# Altium schematic sheet SensorBoard.SchDoc: GROUND WATER MONITORING SYSTEM (part 2 of 2)
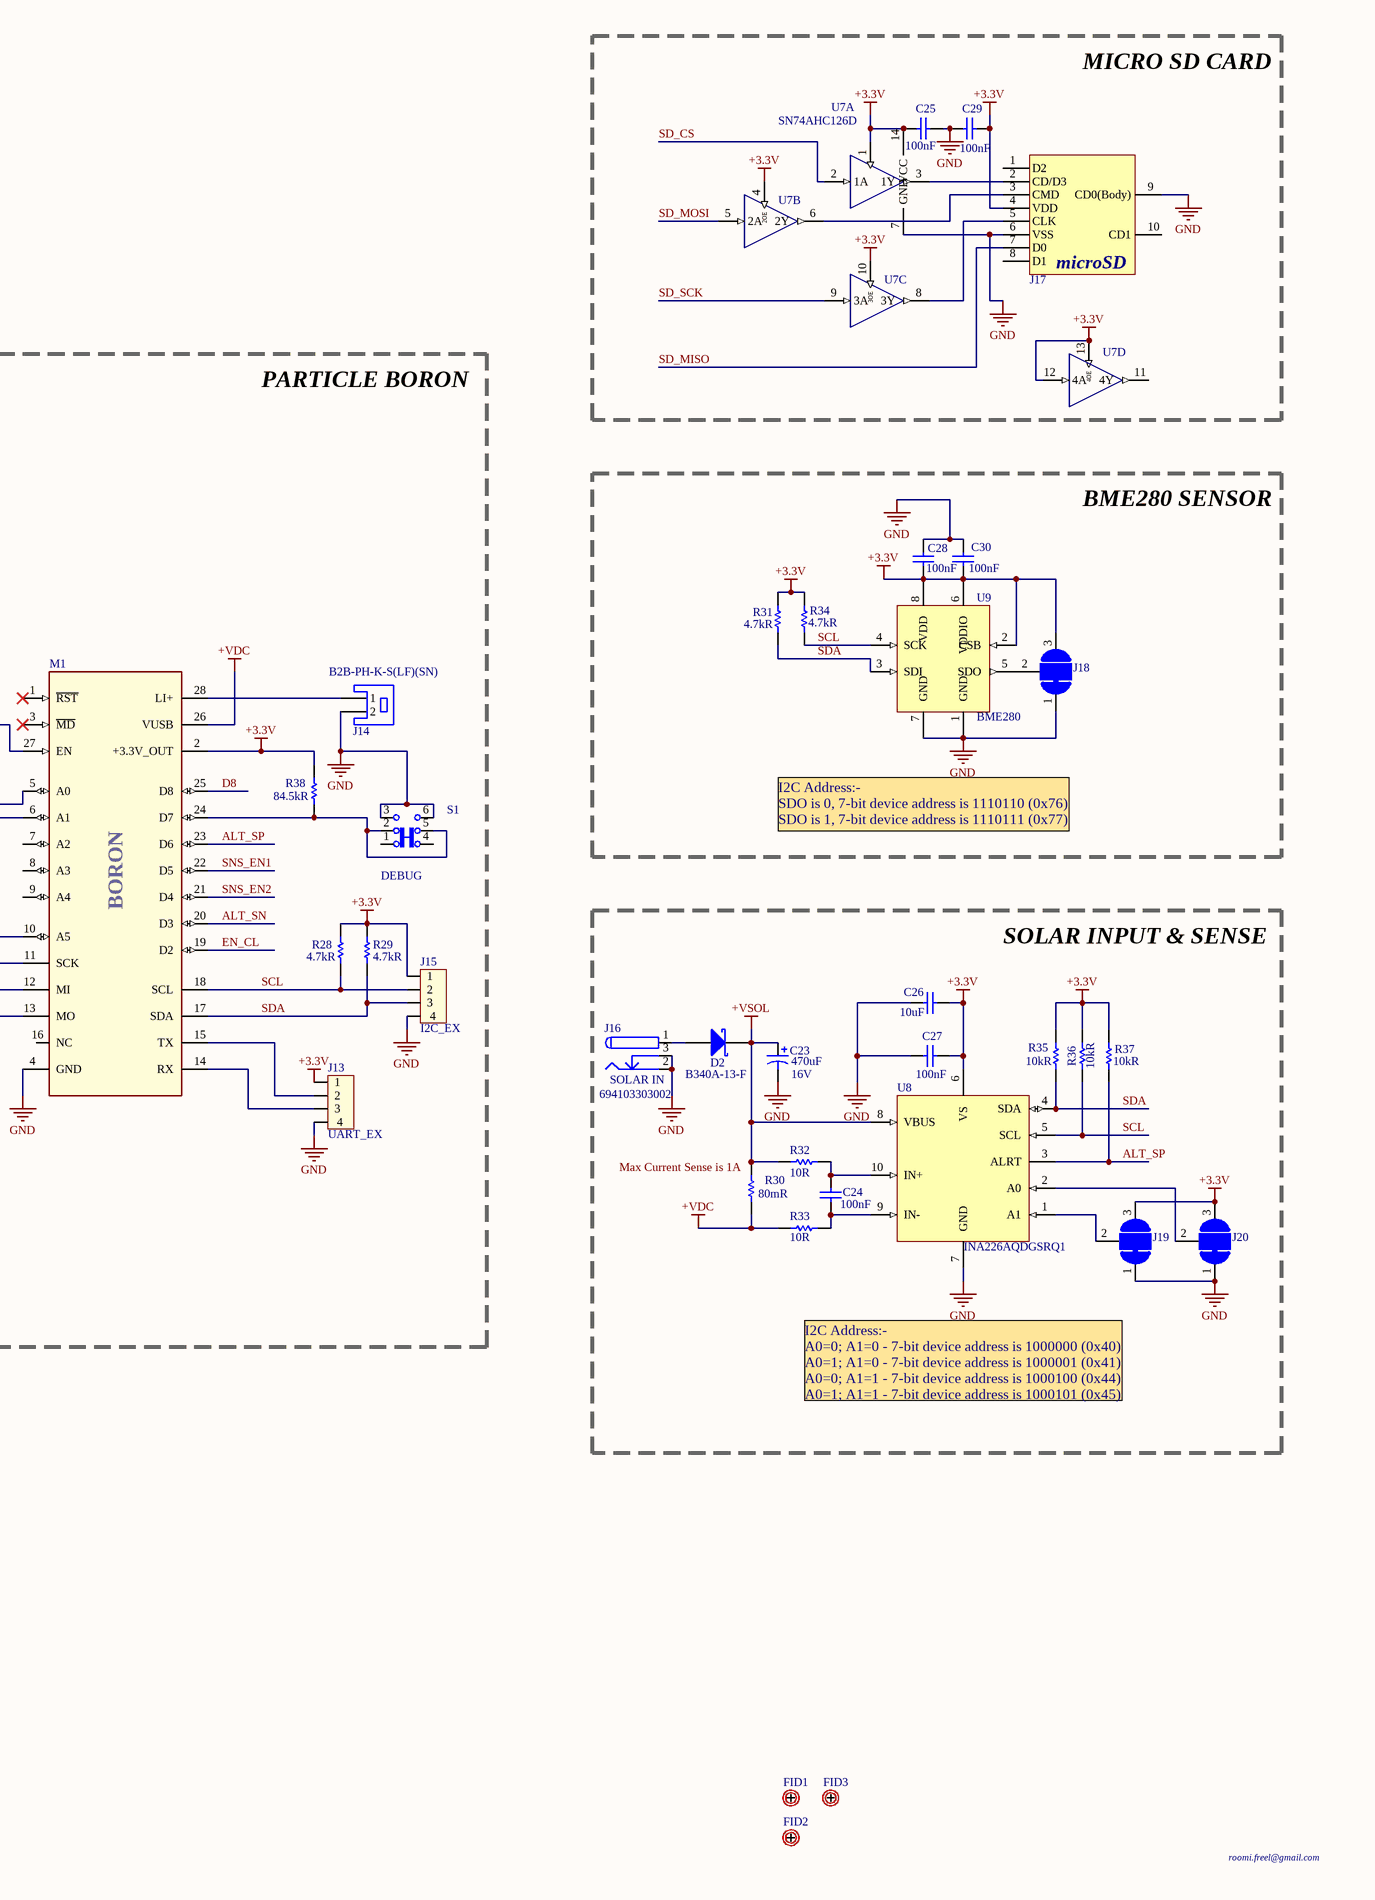
[diagram p2: SensorBoard.SchDoc, right]

## Library data of the parts
C1 C3 C5 C7 C9 C12 C14 C16 C18 = Capacitor: Capacitor Non Polar; Manufacturer: Taiyo Yuden; Manufacturer Part Number: TMK316AB7106KLHT; Tolerance: 10%; Voltage Rating: 25V; Dielectric: X7R; Supplier 1: Digi-Key; Supplier Part Number 1: 587-3485-1-ND; RoHS: Yes; Stock 1: 157997; Pricing 1: 1 = 0.53000, 10 = 0.36800, 100 = 0.22110, 500 = 0.16580, 1000 = 0.14001 (USD); Mount: Surface Mount; Case/Package: 1206; Case Code (Metric): 3216; Case Code (Imperial): 1206; Min Operating Temperature: -55°C; Max Operating Temperature: 125°C; Package Quantity: 2000; Packaging: Tape and Reel; Capacitance: 10uF; Voltage Rating (DC): 25V; Termination: SMD/SMT; Length: 0.126inch; Height: 1.6mm; Width: 0.063inch; Thickness: 0.071inch; Ratings: AEC-Q200; Lead Free: Lead Free; Halogen Free: Halogen Free
C2 C4 C6 C8 C10 C11 C13 C15 C17 C19 C20 C25 C28-C30 = Capacitor: Capacitor Non Polar; Manufacturer: Samsung; Manufacturer Part Number: CL21B104KCFWPNE; Voltage Rating: 100V; Tolerance: 10%; Supplier 1: Digi-Key; Supplier Part Number 1: 1276-6733-1-ND; RoHS: Yes; Stock 1: 24573; Pricing 1: 1 = 0.19000, 10 = 0.13400, 100 = 0.06310, 500 = 0.04422, 1000 = 0.03660 (USD); Mount: Surface Mount; Case/Package: 0805; Case Code (Metric): 2012; Case Code (Imperial): 0805; Min Operating Temperature: -55°C; Max Operating Temperature: 125°C; Packaging: Tape and Reel; Capacitance: 100nF; Features: Soft Termination; Length: 0.079inch; Width: 0.049inch; Thickness: 0.053inch; Ratings: AEC-Q200
C21 = Capacitor: Capacitor Non Polar; Manufacturer: Samsung; Manufacturer Part Number: CL21B471KC6WPNC; Voltage Rating: 100V; Tolerance: 10%; Supplier 1: Digi-Key; Supplier Part Number 1: 1276-6597-1-ND; RoHS: Yes; Stock 1: 22710; Pricing 1: 1 = 0.12000, 10 = 0.08300, 100 = 0.03930, 500 = 0.02752, 1000 = 0.02279 (USD); Mount: Surface Mount; Case/Package: 0805; Case Code (Metric): 2012; Case Code (Imperial): 0805; Min Operating Temperature: -55°C; Max Operating Temperature: 125°C; Packaging: Tape and Reel; Capacitance: 470pF; Features: Soft Termination; Length: 0.079inch; Width: 0.049inch; Thickness: 0.028inch; Ratings: AEC-Q200
C22 = Capacitor: Capacitor Non Polar; Manufacturer: Murata; Manufacturer Part Number: GCJ31CR71E475KA12L; Tolerance: 10%; Voltage Rating: 25V; Dielectric: X7R; Supplier 1: Digi-Key; Supplier Part Number 1: 490-5808-1-ND; RoHS: Yes; Stock 1: 80568; Pricing 1: 1 = 0.82000, 10 = 0.57600, 100 = 0.37950, 500 = 0.28114, 1000 = 0.23897 (USD); Mount: Surface Mount; Case/Package: 1206; Case Code (Imperial): 1206; Case Code (Metric): 3216; Min Operating Temperature: -55°C; Max Operating Temperature: 125°C; Capacitance: 4.7uF; Packaging: Tape and Reel; Package Quantity: 2000; Termination: SMD/SMT; Voltage Rating (DC): 25V; Features: Soft Termination; Length: 0.126inch; Width: 0.063inch; Thickness: 0.075inch; Depth: 1.6mm; Ratings: AEC-Q200; Lead Free: Lead Free; ComponentLink1URL: http://www.murata.com/~/media/webrenewal/support/library/catalog/products/capacitor/mlcc/c03e.ashx; ComponentLink1Description: http://www.murata.com/~/media/webrenewal/support/library/catalog/products/capacitor/mlcc/c03e.ashx; ComponentLink2URL: http://search.murata.co.jp/Ceramy/image/img/A01X/partnumbering_e_02.pdf; ComponentLink2Description: http://search.murata.co.jp/Ceramy/image/img/A01X/partnumbering_e_02.pdf
C23 = Capacitor-Pol: Capacitor Polar; Manufacturer: Panasonic; Manufacturer Part Number: EEEHC1C471P; Dielectric Material: Aluminium; Tolerance: 20%; Ripple Current: 340mA; Life (Hours): 5000Hour; Leakage Current: 3uA; Supplier 1: Digi-Key; Supplier Part Number 1: PCE3751CT-ND; RoHS: Yes; Stock 1: 14134; Pricing 1: 1 = 0.85000, 10 = 0.62600, 100 = 0.42920 (USD); Mount: PCB,Surface Mount; Case/Package: Radial; Number of Pins: 2; Contact Plating: Tin; Min Operating Temperature: -40°C; Max Operating Temperature: 105°C; Capacitance: 470uF; Packaging: Tape and Reel; Voltage Rating: 16V; Package Quantity: 500; Ripple Current (AC): 340mA; Polarity: Polar; Termination: SMD/SMT; Voltage: 16V; Diameter: 10mm; Length: 10.2mm; Height: 10.2mm; Height - Seated (Max): 0.402inch; Lead Pitch: 4.6mm; Width: 900um; Radiation Hardening: No; REACH SVHC: No SVHC; Lead Free: Lead Free; ComponentLink1URL: http://www.farnell.com/datasheets/2059746.pdf; ComponentLink1Description: http://www.farnell.com/datasheets/2059746.pdf; ComponentLink2URL: http://industrial.panasonic.com/www-data/pdf/ABA0000/ABA0000CE109.pdf; ComponentLink2Description: http://industrial.panasonic.com/www-data/pdf/ABA0000/ABA0000CE109.pdf; ComponentLink3URL: http://www.farnell.com/datasheets/2244689.pdf; ComponentLink3Description: http://www.farnell.com/datasheets/2244689.pdf; ComponentLink4URL: http://www.farnell.com/datasheets/370234.pdf; ComponentLink4Description: http://www.farnell.com/datasheets/370234.pdf; ComponentLink5URL: https://www.alliedelec.com/m/d/b5cedb557dd62c1c43280c1d7d86d6d0.pdf; ComponentLink5Description: https://www.alliedelec.com/m/d/b5cedb557dd62c1c43280c1d7d86d6d0.pdf; ComponentLink6URL: http://www.mouser.com/ds/2/315/ABA0000C1160-947462.pdf; ComponentLink6Description: http://www.mouser.com/ds/2/315/ABA0000C1160-947462.pdf; ComponentLink7URL: http://uk.rs-online.com/webdocs/0f32/0900766b80f32c51.pdf; ComponentLink7Description: http://uk.rs-online.com/webdocs/0f32/0900766b80f32c51.pdf
C24 C27 = Capacitor: Ceramic Chip Capacitor; Manufacturer: Samsung; Manufacturer Part Number: CL21B104KCFWPNE; Voltage Rating: 100V; Tolerance: 10%; Supplier 1: Digi-Key; Supplier Part Number 1: 1276-6733-1-ND; RoHS: Yes; Stock 1: 24573; Pricing 1: 1 = 0.19000, 10 = 0.13400, 100 = 0.06310, 500 = 0.04422, 1000 = 0.03660 (USD); Mount: Surface Mount; Case/Package: 0805; Case Code (Metric): 2012; Case Code (Imperial): 0805; Min Operating Temperature: -55°C; Max Operating Temperature: 125°C; Packaging: Tape and Reel; Capacitance: 100nF; Features: Soft Termination; Length: 0.079inch; Width: 0.049inch; Thickness: 0.053inch; Ratings: AEC-Q200
C26 = Capacitor: Ceramic Chip Capacitor; Manufacturer: Taiyo Yuden; Manufacturer Part Number: TMK316AB7106KLHT; Tolerance: 10%; Voltage Rating: 25V; Dielectric: X7R; Supplier 1: Digi-Key; Supplier Part Number 1: 587-3485-1-ND; RoHS: Yes; Stock 1: 157997; Pricing 1: 1 = 0.53000, 10 = 0.36800, 100 = 0.22110, 500 = 0.16580, 1000 = 0.14001 (USD); Mount: Surface Mount; Case/Package: 1206; Case Code (Metric): 3216; Case Code (Imperial): 1206; Min Operating Temperature: -55°C; Max Operating Temperature: 125°C; Package Quantity: 2000; Packaging: Tape and Reel; Capacitance: 10uF; Voltage Rating (DC): 25V; Termination: SMD/SMT; Length: 0.126inch; Height: 1.6mm; Width: 0.063inch; Thickness: 0.071inch; Ratings: AEC-Q200; Lead Free: Lead Free; Halogen Free: Halogen Free
D1 = Diode_Schottky: Manufacturer: ON Semiconductor / Fairchild; Average Rectified Current: 1A; Reverse Recovery Time: 5.695ns; Element Configuration: Single; Max Forward Surge Current (Ifsm): 40A; Max Repetitive Reverse Voltage (Vrrm): 40V; Supplier 1: Digi-Key; Supplier Part Number 1: SS14FLCT-ND; RoHS: Yes; Stock 1: 49252; Pricing 1: 1 = 0.350000, 10 = 0.263000, 100 = 0.148900, 500 = 0.098620, 1000 = 0.075610 (USD); Mount: Surface Mount; Case/Package: SOD; Weight: 0.0276g; Packaging: Tape and Reel; Max Reverse Voltage (DC): 40V
D2 = Diode_Schottky: Manufacturer: Diodes; Forward Current: 3A; Peak Reverse Current: 500uA; Forward Voltage: 500mV; Max Repetitive Reverse Voltage (Vrrm): 40V; Max Forward Surge Current (Ifsm): 80A; Element Configuration: Single; Polarity: Standard; Capacitance: 250pF; Supplier 1: Digi-Key; Supplier Part Number 1: B340A-FDICT-ND; RoHS: Yes; Stock 1: 741506; Pricing 1: 1 = 0.46000, 10 = 0.37300, 100 = 0.25380, 500 = 0.19034, 1000 = 0.14276 (USD); Mount: Surface Mount; Case/Package: SMA; Number of Pins: 2; Weight: 0.002258oz; Contact Plating: Matte,Tin; Min Operating Temperature: -55°C; Max Operating Temperature: 125°C; Packaging: Tape and Reel; Package Quantity: 5000; Average Rectified Current: 3A; Peak Non-Repetitive Surge Current: 80A; Termination: SMD/SMT; Voltage Rating (DC): 40V; Current Rating: 3A; Output Current: 3A; Current: 3A; Voltage: 40V; Max Reverse Voltage (DC): 40V; Length: 4.6mm; Height: 2.3mm; Width: 2.92mm; Radiation Hardening: No; REACH SVHC: No SVHC; Lead Free: Lead Free; ComponentLink1URL: http://components.arrow.com/part/dataview/41507737S9851045N2867; ComponentLink1Description: http://components.arrow.com/part/dataview/41507737S9851045N2867; ComponentLink2URL: http://www.farnell.com/datasheets/1911813.pdf; ComponentLink2Description: http://www.farnell.com/datasheets/1911813.pdf; ComponentLink3URL: http://www.farnell.com/datasheets/2238474.pdf; ComponentLink3Description: http://www.farnell.com/datasheets/2238474.pdf; ComponentLink4URL: https://www.diodes.com/assets/Datasheets/ds30891.pdf; ComponentLink4Description: https://www.diodes.com/assets/Datasheets/ds30891.pdf; ComponentLink5URL: https://www.verical.com/server-webapp/html/getDatasheet?partID=143394; ComponentLink5Description: https://www.verical.com/server-webapp/html/getDatasheet?partID=143394
FID1-FID3 = Fiducials: Alignment mark for the pick & place machine
J1 J2 = TERM_BLK-2P: Terminal Block 2 position; Manufacturer: Phoenix Contact; Manufacturer Part Number: 1729128; Current Rating: 13.5A; Number of Poles: 2; Voltage Rating: 400V; Number of Levels: 1; Current: 10A; Voltage: 300V; Connector Type: Screw; Test Voltage: 4kV; Wire Gauge (Max): 26AWG; Wire Gauge (Min): 14AWG; Pitch: 5.08mm; Approvals: CSA,UL; Supplier 1: Digi-Key; Supplier Part Number 1: 277-1247-ND; RoHS: Yes; Stock 1: 62; Pricing 1: 1 = 1.10000, 10 = 1.05100, 50 = 1.00480, 100 = 0.97740, 250 = 0.91352, 500 = 0.84042, 1000 = 0.77647, 2500 = 0.73994, 5000 = 0.69426 (USD); Mount: Through Hole; Number of Pins: 2; Weight: 0.069842oz; Housing Material: Polyamide; Color: Green; Housing Color: Green; Insulation Material: Nylon; Contact Material: Tin; Min Operating Temperature: -20°C; Max Operating Temperature: 100°C; Package Quantity: 50; Packaging: Bulk; Termination: Screw; Max Current Rating: 13.5A; Number of Rows: 1; Max Supply Voltage: 400V; Number of Positions Per Level: 2; Number of Positions: 2; Number of Contacts: 2; Number of Circuits: 2; Orientation: Straight; Length: 8.1mm; Height: 13.5mm; Width: 13.5mm; Depth: 8.1mm; Wire/Cable Gauge: 26AWG; Radiation Hardening: No; Lead Free: Lead Free; REACH SVHC: No SVHC; Flammability Rating: UL94 V-0; ComponentLink1URL: https://media.digikey.com/pdf/Data%20Sheets/Phoenix%20Contact%20PDFs/1729128.pdf; ComponentLink1Description: https://media.digikey.com/pdf/Data%20Sheets/Phoenix%20Contact%20PDFs/1729128.pdf; ComponentLink2URL: http://www.alliedelec.com/m/d/8fbcabaafcd0c56253c6cd72df81298d.pdf; ComponentLink2Description: http://www.alliedelec.com/m/d/8fbcabaafcd0c56253c6cd72df81298d.pdf; ComponentLink3URL: https://www.verical.com/server-webapp/html/getDatasheet?partID=199310; ComponentLink3Description: https://www.verical.com/server-webapp/html/getDatasheet?partID=199310; ComponentLink4URL: https://produktinfo.conrad.com/datenblaetter/725000-749999/743664-da-01-en-PRINTKLEMMENBLOCK_MKDSN_1_5__2_5_08.pdf; ComponentLink4Description: https://produktinfo.conrad.com/datenblaetter/725000-749999/743664-da-01-en-PRINTKLEMMENBLOCK_MKDSN_1_5__2_5_08.pdf
J3 = HDR 1X3: HEADER 1X3
J4 J18-J20 = Jumper-3P_NC
J5-J8 = HDR 1X3: HEADER 1X3; Manufacturer: Sullins; Manufacturer Part Number: PPPC031LFBN-RC; Number of Positions: 3; Connector Type: Header,Socket; Pitch: 0.1inch; Supplier 1: Digi-Key; Supplier Part Number 1: S7036-ND; RoHS: Yes; Stock 1: 16844; Pricing 1: 1 = 0.37000, 10 = 0.35100, 100 = 0.26910, 500 = 0.23400, 1000 = 0.19305, 5000 = 0.16965, 10000 = 0.16900 (USD); Mount: Through Hole; Color: Black; Contact Plating: Gold; Contact Material: Bronze; Housing Material: Plastic; Package Quantity: 1000; Number of Rows: 1; Packaging: Bulk; Termination: Solder; Length: 8.12mm; Height: 8.5mm; Width: 2.5mm; Lead Free: Lead Free
J9 J10 = TERM_BLK-2P: Terminal Block 2 position; Manufacturer: Phoenix Contact; Manufacturer Part Number: 1729128; Number of Positions: 2; Voltage Rating: 400V; Current Rating: 13.5A; Connector Type: Screw; Number of Levels: 1; Current: 10A; Voltage: 300V; Test Voltage: 4kV; Pitch: 5.08mm; Wire Gauge (Max): 26AWG; Wire Gauge (Min): 14AWG; Approvals: CSA,UL; Supplier 1: Digi-Key; Supplier Part Number 1: 277-1247-ND; RoHS: Yes; Stock 1: 62; Pricing 1: 1 = 1.10000, 10 = 1.05100, 50 = 1.00480, 100 = 0.97740, 250 = 0.91352, 500 = 0.84042, 1000 = 0.77647, 2500 = 0.73994, 5000 = 0.69426 (USD); Mount: Through Hole; Number of Pins: 2; Weight: 0.069842oz; Color: Green; Housing Material: Polyamide; Housing Color: Green; Contact Material: Tin; Insulation Material: Nylon; Min Operating Temperature: -20°C; Max Operating Temperature: 100°C; Packaging: Bulk; Termination: Screw; Orientation: Straight; Number of Poles: 2; Package Quantity: 50; Number of Rows: 1; Number of Contacts: 2; Number of Positions Per Level: 2; Max Current Rating: 13.5A; Max Supply Voltage: 400V; Number of Circuits: 2; Length: 8.1mm; Height: 13.5mm; Depth: 8.1mm; Width: 13.5mm; Wire/Cable Gauge: 26AWG; Radiation Hardening: No; REACH SVHC: No SVHC; Flammability Rating: UL94 V-0; Lead Free: Lead Free; ComponentLink1URL: https://media.digikey.com/pdf/Data%20Sheets/Phoenix%20Contact%20PDFs/1729128.pdf; ComponentLink1Description: https://media.digikey.com/pdf/Data%20Sheets/Phoenix%20Contact%20PDFs/1729128.pdf; ComponentLink2URL: http://www.alliedelec.com/m/d/8fbcabaafcd0c56253c6cd72df81298d.pdf; ComponentLink2Description: http://www.alliedelec.com/m/d/8fbcabaafcd0c56253c6cd72df81298d.pdf; ComponentLink3URL: https://www.verical.com/server-webapp/html/getDatasheet?partID=199310; ComponentLink3Description: https://www.verical.com/server-webapp/html/getDatasheet?partID=199310; ComponentLink4URL: https://produktinfo.conrad.com/datenblaetter/725000-749999/743664-da-01-en-PRINTKLEMMENBLOCK_MKDSN_1_5__2_5_08.pdf; ComponentLink4Description: https://produktinfo.conrad.com/datenblaetter/725000-749999/743664-da-01-en-PRINTKLEMMENBLOCK_MKDSN_1_5__2_5_08.pdf
J11 = HDR 1X2: HEADER 1X2
J12 = TERM_BLK-5P: Terminal Block 5 position; Manufacturer: Phoenix Contact; Manufacturer Part Number: 1729157; Current Rating: 13.5A; Number of Positions: 5; Max Supply Voltage: 250V; Number of Levels: 1; Current: 10A; Voltage: 300V; Connector Type: Screw; Wire Gauge (Max): 26AWG; Wire Gauge (Min): 14AWG; Pitch: 5.08mm; Stripping Length: 6mm; Approvals: CB,CSA,cULus,UL; Supplier 1: Digi-Key; Supplier Part Number 1: 277-1250-ND; Stock 1: 3989; Pricing 1: 1 = 2.75000, 10 = 2.63200, 50 = 2.51800, 100 = 2.44920, 250 = 2.28900, 500 = 2.10590, 1000 = 1.94566, 2500 = 1.85409, 5000 = 1.73965 (USD); RoHS: Yes; Mount: Through Hole; Number of Pins: 5; Weight: 0.160849oz; Color: Green; Material: Nylon; Housing Color: Green; Housing Material: Polyamide; Contact Material: Tin; Insulation Material: Nylon; Package Quantity: 50; Packaging: Bulk; Termination: Solder; Max Current Rating: 13.5A; Number of Rows: 1; Voltage Rating: 250V; Number of Positions Per Level: 5; Number of Contacts: 5; Orientation: Straight; Number of Poles: 5; Number of Circuits: 5; Length: 8.1mm; Height: 13.5mm; Wire/Cable Gauge: 26AWG; Depth: 8.1mm; Width: 25.4mm; Radiation Hardening: No; REACH SVHC: No SVHC; Lead Free: Lead Free; Flammability Rating: UL94 V-0; ComponentLink1URL: https://media.digikey.com/pdf/Data%20Sheets/Phoenix%20Contact%20PDFs/1729157.pdf?src-supplier=Digi-Key; ComponentLink1Description: https://media.digikey.com/pdf/Data%20Sheets/Phoenix%20Contact%20PDFs/1729157.pdf?src-supplier=Digi-Key; ComponentLink2URL: https://www.verical.com/server-webapp/html/getDatasheet?partID=238078&src-supplier=Verical; ComponentLink2Description: https://www.verical.com/server-webapp/html/getDatasheet?partID=238078&src-supplier=Verical; ComponentLink3URL: https://www.alliedelec.com/m/d/55f89f4a8d0b80308322c2ef4a018ccf.pdf?src-supplier=Allied+Electronics; ComponentLink3Description: https://www.alliedelec.com/m/d/55f89f4a8d0b80308322c2ef4a018ccf.pdf?src-supplier=Allied+Electronics; ComponentLink4URL: http://www.farnell.com/datasheets/2309723.pdf?src-supplier=Farnell; ComponentLink4Description: http://www.farnell.com/datasheets/2309723.pdf?src-supplier=Farnell
J13 J15 = HDR 1X4: HEADER 1X4
J14 = JST-2P: JST 2 Pin, Shrouded Connector; Connector Type: Male Pin; Current Rating: 2A; Number of Positions: 2; Contact Resistance: 20mR; Gender: Male; Voltage Rating: 100V; Insulation Resistance: 1MR; Pitch: 2mm; Supplier 1: Digi-Key; Supplier Part Number 1: 455-1704-ND; Manufacturer: JST; RoHS: Yes; Stock 1: 457571; Pricing 1: 1 = 0.170000, 10 = 0.162000, 100 = 0.100200, 500 = 0.082880, 1000 = 0.072520, 5000 = 0.062160, 10000 = 0.060440 (USD); Mount: Through Hole; Number of Pins: 2; Contact Material: Brass,Tin; Contact Plating: Copper,Tin; Color: Natural; Housing Color: White; Housing Material: Polyamide; Min Operating Temperature: -25°C; Max Operating Temperature: 85°C; Termination: Solder; Number of Rows: 1; Packaging: Bulk; Fastening Type: Detent; Number of Contacts: 2; Orientation: Straight; Max Current Rating: 2A; Max Voltage Rating (AC): 100V; Number of Poles: 2; Voltage Rating (AC): 100V; Working Voltage: 100V; Max Voltage Rating (DC): 100V; Length: 5.9mm; Height: 9.4mm; Width: 4.5mm; Contact Mating Length: 0.13inch; Depth: 4.5mm; Lead Pitch: 2mm; Lead Free: Lead Free; REACH SVHC: No SVHC; ComponentLink1URL: http://www.farnell.com/datasheets/2057211.pdf; ComponentLink1Description: http://www.farnell.com/datasheets/2057211.pdf; ComponentLink2URL: http://www.jst-mfg.com/product/pdf/eng/ePH.pdf; ComponentLink2Description: http://www.jst-mfg.com/product/pdf/eng/ePH.pdf; ComponentLink3URL: http://www1.futureelectronics.com/doc/JST/B2B-PH-K-S(LF)(SN).pdf; ComponentLink3Description: http://www1.futureelectronics.com/doc/JST/B2B-PH-K-S(LF)(SN).pdf
J16 = Barrel Jack: DC Barrel Jack Connector Male; Manufacturer: Wurth Electronics; Shielding: Unshielded; Current Rating: 2A; Voltage Rating: 30V; Connector Type: Jack,Power; Insulation Resistance: 100MR; ComponentLink1Description: Manufacturer Link; ComponentLink1URL: http://domino.kycon.com/internet/Products.html; Supplier 1: Digi-Key; Supplier Part Number 1: 732-5925-ND; RoHS: Yes; Stock 1: 1123; Pricing 1: 1 = 0.84000, 10 = 0.80100, 50 = 0.71500, 100 = 0.65800, 500 = 0.57200, 1000 = 0.48700 (USD); Mount: Through Hole; Contact Plating: Tin; Color: Black; Contact Material: Copper Alloy; Housing Material: Polyamide; Min Operating Temperature: -40°C; Max Operating Temperature: 85°C; Packaging: Bulk; Gender: Male; Termination: Through Hole; Contact Gender: Female; Package Quantity: 1000; Voltage Rating (DC): 30V; REACH SVHC: Unknown; Flammability Rating: UL94 V-0
J17 = MicroSD: MicroSD Connector; Manufacturer: Hirose; Manufacturer Part Number: DM3CS-SF; Max Current Rating: 500mA; Number of Contacts: 8; Contact Resistance: 100mR; Voltage Rating (AC): 125V; Gender: Female; Connector Type: Connector,Socket; Insulation Resistance: 1GR; Pitch: 1.1mm; Supplier 1: Digi-Key; Supplier Part Number 1: HR1972CT-ND; RoHS: Yes; Stock 1: 67611; Pricing 1: 1 = 1.51000, 10 = 1.37400, 25 = 1.29040, 50 = 1.23420, 100 = 1.17810, 250 = 1.06592, 500 = 0.98176 (USD); Mount: Surface Mount; Contact Material: Copper,Copper Alloy,Gold; Contact Plating: Gold; Housing Material: Polymer; Min Operating Temperature: -25°C; Max Operating Temperature: 85°C; Number of Rows: 1; Orientation: Right Angle; Package Quantity: 1; Packaging: Tape and Reel; Current Rating: 500mA; Termination: Solder; Number of Positions: 8; Length: 14.1mm; Width: 13.8mm; Depth: 1.83mm; Radiation Hardening: No; REACH SVHC: Unknown; Lead Free: Lead Free; Flammability Rating: UL94 V-0; ComponentLink1URL: https://www.hirose.com/product/en/download_file/key_name/DM3CS-SF/category/Specification%20Sheet/doc_file_id/44102/?file_category_id=9&item_id=06090032300&is_series=; ComponentLink1Description: https://www.hirose.com/product/en/download_file/key_name/DM3CS-SF/category/Specification%20Sheet/doc_file_id/44102/?file_category_id=9&item_id=06090032300&is_series=; ComponentLink2URL: http://www.farnell.com/datasheets/1697167.pdf; ComponentLink2Description: http://www.farnell.com/datasheets/1697167.pdf; ComponentLink3URL: http://www.hirose.co.jp/cataloge_hp/e60900232.pdf; ComponentLink3Description: http://www.hirose.co.jp/cataloge_hp/e60900232.pdf; ComponentLink4URL: http://www.mouser.com/ds/2/185/DM3_catalog-939223.pdf; ComponentLink4Description: http://www.mouser.com/ds/2/185/DM3_catalog-939223.pdf
L1 = Inductor: Generic Inductor; Manufacturer: Taiyo Yuden; Manufacturer Part Number: NR5040T100M; Core Material: Ferrite; Tolerance: 20%; Current Rating: 2.1A; Saturation Current: 2.3A; Shielding: Shielded; Self Resonant Frequency: 18MHz; DC Resistance (DCR): 72.8mR; Test Frequency: 100kHz; Supplier 1: Digi-Key; Supplier Part Number 1: 587-2365-1-ND; RoHS: Yes; Stock 1: 25005; Pricing 1: 1 = 0.45000, 10 = 0.39000, 100 = 0.27890, 500 = 0.23426 (USD); Mount: Surface Mount; Case/Package: Nonstandard; Number of Pins: 2; Min Operating Temperature: -25°C; Max Operating Temperature: 120°C; Packaging: Tape and Reel; Package Quantity: 1500; Inductance Tolerance: 20%; Composition: Wirewound; Inductance: 10uH; Max DC Current: 2.3A; Termination: SMD/SMT; RMS Current (Irms): 2.1A; Length: 0.193inch; Height: 4mm; Width: 0.193inch; Height - Seated (Max): 0.161inch; Depth: 5.1mm; Radiation Hardening: No; REACH SVHC: Unknown; Halogen Free: Halogen Free; ComponentLink1URL: https://www.yuden.co.jp/productdata/catalog/en/wound04_e.pdf; ComponentLink1Description: https://www.yuden.co.jp/productdata/catalog/en/wound04_e.pdf; ComponentLink2URL: https://www.yuden.co.jp/productdata/catalog/wound04_e.pdf; ComponentLink2Description: https://www.yuden.co.jp/productdata/catalog/wound04_e.pdf; ComponentLink3URL: http://www.yuden.co.jp/productdata/catalog/en/wound04_e.pdf; ComponentLink3Description: http://www.yuden.co.jp/productdata/catalog/en/wound04_e.pdf; ComponentLink4URL: http://www.mouser.com/ds/2/396/wound04_e-8385.pdf; ComponentLink4Description: http://www.mouser.com/ds/2/396/wound04_e-8385.pdf
M1 = Particle: Particle BORON, ARGON and XENON Module; Manufacturer: Particle; Mounting Type: Through Hole; Operating Temperature: -20°C ~ 60°C; Package / Case: Module; ComponentLink1URL: http://www.microchip.com/mymicrochip/filehandler.aspx?ddocname=en570043; ComponentLink1Description: http://www.microchip.com/mymicrochip/filehandler.aspx?ddocname=en570043
Q1 Q2 = MOSFET-N_D: N-Channel Power MOSFET with Diode; Manufacturer: ON Semiconductor; Rds On Max: 1.6R; Continuous Drain Current (ID): 320mA; Input Capacitance: 24.5pF; Max Power Dissipation: 420mW; Gate to Source Voltage (Vgs): 20V; Power Dissipation: 300mW; Drain to Source Breakdown Voltage: 60V; Element Configuration: Single; Number of Elements: 1; Turn-Off Delay Time: 55.8ns; Turn-On Delay Time: 12.2ns; Rise Time: 9ns; Nominal Vgs: 2.3V; ComponentLink1Description: Manufacturer Link; ComponentLink1URL: http://www.irf.com/; Supplier 1: Digi-Key; Supplier Part Number 1: 2N7002KT1GOSCT-ND; RoHS: Yes; Stock 1: 21780; Pricing 1: 1 = 0.21000, 10 = 0.19300, 100 = 0.12640, 500 = 0.06180, 1000 = 0.04214 (USD); Case/Package: SOT-23-3; Number of Pins: 3; Contact Plating: Matte,Tin; Min Operating Temperature: -55°C; Max Operating Temperature: 150°C; Packaging: Tape and Reel; Drain to Source Resistance: 1.6R; Package Quantity: 1; Fall Time: 9ns; On-State Resistance: 1.6R; Threshold Voltage: 2.3V; Length: 3.04mm; Height: 1.01mm; Width: 1.4mm; Radiation Hardening: No; Lead Free: Lead Free; REACH SVHC: No SVHC; Halogen Free: Halogen Free; ComponentLink2URL: http://www.mouser.com/ds/2/308/2N7002K-D-40616.pdf; ComponentLink2Description: http://www.mouser.com/ds/2/308/2N7002K-D-40616.pdf; ComponentLink3URL: http://www.farnell.com/datasheets/2354033.pdf; ComponentLink3Description: http://www.farnell.com/datasheets/2354033.pdf; ComponentLink4URL: http://www.onsemi.ru.com/pub/Collateral/2N7002K-D.PDF; ComponentLink4Description: http://www.onsemi.ru.com/pub/Collateral/2N7002K-D.PDF; ComponentLink5URL: https://www.verical.com/server-webapp/html/getDatasheet?partID=309924; ComponentLink5Description: https://www.verical.com/server-webapp/html/getDatasheet?partID=309924; ComponentLink6URL: http://www.onsemi.com/pub_link/Collateral/2N7002K-D.PDF; ComponentLink6Description: http://www.onsemi.com/pub_link/Collateral/2N7002K-D.PDF; ComponentLink7URL: http://uk.rs-online.com/webdocs/13e9/0900766b813e9f06.pdf; ComponentLink7Description: http://uk.rs-online.com/webdocs/13e9/0900766b813e9f06.pdf; ComponentLink8URL: http://www.onsemi.com/pub/Collateral/2N7002K-D.PDF; ComponentLink8Description: http://www.onsemi.com/pub/Collateral/2N7002K-D.PDF
R1 R2 R7 R8 R18 = Resistor: Generic Resistor; Manufacturer: Yageo; Manufacturer Part Number: AC0805FR-071ML; Power Rating: 125mW; Tolerance: 1%; Voltage Rating: 150V; Temperature Coefficient: 100ppm/°C; Supplier 1: Digi-Key; Supplier Part Number 1: YAG3704CT-ND; RoHS: Yes; Stock 1: 16924; Pricing 1: 1 = 0.10000, 10 = 0.05000, 100 = 0.02050, 1000 = 0.00921, 2500 = 0.00799 (USD); Case/Package: 0805; Case Code (Imperial): 0805; Case Code (Metric): 2012; Min Operating Temperature: -55°C; Max Operating Temperature: 155°C; Packaging: Tape and Reel; Resistance: 1MR; Composition: Thick Film; Number of Terminations: 2; Termination: SMD/SMT; Max Power Dissipation: 125mW; Features: Automotive AEC-Q200,Moisture Resistant; Length: 0.079inch; Height: 0.024inch; Width: 0.049inch; Lead Free: Lead Free
R3-R6 R20-R23 R28 R29 R31 R34 = Resistor: Generic Resistor; Manufacturer: Yageo; Manufacturer Part Number: AC0805FR-074K7L; Tolerance: 1%; Temperature Coefficient: 100ppm/°C; Power Rating: 125mW; Voltage Rating: 150V; Supplier 1: Digi-Key; Supplier Part Number 1: YAG3738CT-ND; RoHS: Yes; Stock 1: 7830; Pricing 1: 1 = 0.10000, 10 = 0.05000, 100 = 0.02050, 1000 = 0.00921, 2500 = 0.00799 (USD); Case/Package: 0805; Case Code (Imperial): 0805; Case Code (Metric): 2012; Min Operating Temperature: -55°C; Max Operating Temperature: 155°C; Resistance: 4.7kR; Composition: Thick Film; Packaging: Tape and Reel; Termination: SMD/SMT; Number of Terminations: 2; Military Standard: Not; Max Power Dissipation: 125mW; Features: Automotive AEC-Q200,Moisture Resistant; Length: 2mm; Height: 0.024inch; Width: 0.049inch; Depth: 1.25mm; Lead Free: Lead Free; ComponentLink1URL: http://www.mouser.com/ds/2/447/yageodocoutput-1111992.pdf; ComponentLink1Description: http://www.mouser.com/ds/2/447/yageodocoutput-1111992.pdf
R9 R10 = Resistor: Generic Resistor; Manufacturer: Yageo; Manufacturer Part Number: RC0805FR-074R99L; Tolerance: 1%; Temperature Coefficient: 200ppm/°C; Power Rating: 125mW; Voltage Rating: 150V; Supplier 1: Digi-Key; Supplier Part Number 1: 311-4.99CRCT-ND; RoHS: Yes; Stock 1: 471256; Pricing 1: 1 = 0.10000, 10 = 0.07500, 100 = 0.02880, 1000 = 0.01268, 2500 = 0.01095 (USD); Case/Package: 0805; Weight: 0.000194oz; Case Code (Metric): 2012; Case Code (Imperial): 0805; Min Operating Temperature: -55°C; Max Operating Temperature: 155°C; Resistance: 4.99R; Composition: Thick Film; Packaging: Tape and Reel; Termination: SMD/SMT; Military Standard: Not; Voltage Rating (DC): 150V; Number of Terminations: 2; Max Power Dissipation: 125mW; Features: Moisture Resistant; Package Quantity: 1; Length: 2mm; Height: 0.024inch; Width: 0.049inch; Depth: 1.25mm; Lead Free: Lead Free; ComponentLink1URL: http://www.yageo.com/documents/recent/PYu-RC_Group_51_RoHS_L_9.pdf; ComponentLink1Description: http://www.yageo.com/documents/recent/PYu-RC_Group_51_RoHS_L_9.pdf; ComponentLink2URL: http://www.yageo.com/documents/recent/PYu-RC_Group_51_RoHS_L_10.pdf; ComponentLink2Description: http://www.yageo.com/documents/recent/PYu-RC_Group_51_RoHS_L_10.pdf; ComponentLink3URL: http://www.yageo.ru/pdf/RC0805.pdf; ComponentLink3Description: http://www.yageo.ru/pdf/RC0805.pdf; ComponentLink4URL: http://www.mouser.com/ds/2/447/Yageo_08112016_RC0805-968729.pdf; ComponentLink4Description: http://www.mouser.com/ds/2/447/Yageo_08112016_RC0805-968729.pdf
R11 R19 R38 = Resistor: Generic Resistor; Manufacturer: Vishay; Manufacturer Part Number: CRCW080584K5FKEA; Tolerance: 1%; Power Rating: 125mW; Voltage Rating: 150V; Temperature Coefficient: 100ppm/°C; Supplier 1: Digi-Key; Supplier Part Number 1: 541-84.5KCCT-ND; RoHS: Yes; Stock 1: 16539; Pricing 1: 1 = 0.10000, 10 = 0.06900, 100 = 0.02800, 1000 = 0.01256, 2500 = 0.01090 (USD); Mount: Surface Mount; Case/Package: 0805; Number of Pins: 2; Weight: 0.000194oz; Case Code (Metric): 2012; Case Code (Imperial): 0805; Contact Plating: Tin; Min Operating Temperature: -55°C; Max Operating Temperature: 155°C; Packaging: Tape and Reel; Resistance: 84.5kR; Package Quantity: 10; Composition: Thick Film; Number of Terminations: 2; Military Standard: Not; Max Power Dissipation: 125mW; Voltage Rating (DC): 150V; Features: Automotive AEC-Q200; Length: 2mm; Height: 0.02inch; Width: 0.049inch; Depth: 1.25mm; Radiation Hardening: No; REACH SVHC: Unknown; Lead Free: Lead Free; ComponentLink1URL: http://www.vishay.com/docs/20035/dcrcwe3.pdf; ComponentLink1Description: http://www.vishay.com/docs/20035/dcrcwe3.pdf; ComponentLink2URL: http://www.farnell.com/datasheets/2049244.pdf; ComponentLink2Description: http://www.farnell.com/datasheets/2049244.pdf; ComponentLink3URL: http://www.farnell.com/datasheets/2111203.pdf; ComponentLink3Description: http://www.farnell.com/datasheets/2111203.pdf; ComponentLink4URL: http://www.mouser.com/ds/2/427/dcrcwe3-109170.pdf; ComponentLink4Description: http://www.mouser.com/ds/2/427/dcrcwe3-109170.pdf
R12-R17 = Resistor: Generic Resistor; Manufacturer: Yageo; Manufacturer Part Number: AC0805FR-071K5L; Power Rating: 125mW; Tolerance: 1%; Voltage Rating: 150V; Temperature Coefficient: 100ppm/°C; Supplier 1: Digi-Key; Supplier Part Number 1: YAG3701CT-ND; RoHS: Yes; Stock 1: 5572; Pricing 1: 1 = 0.10000, 10 = 0.05000, 100 = 0.02050, 1000 = 0.00921, 2500 = 0.00799 (USD); Case/Package: 0805; Case Code (Imperial): 0805; Case Code (Metric): 2012; Min Operating Temperature: -55°C; Max Operating Temperature: 155°C; Packaging: Tape and Reel; Resistance: 1.5kR; Composition: Thick Film; Termination: SMD/SMT; Number of Terminations: 2; Max Power Dissipation: 125mW; Features: Automotive AEC-Q200,Moisture Resistant; Length: 0.079inch; Height: 0.024inch; Width: 0.049inch
R24 = Resistor: Generic Resistor; Published: 8-Jun-2000; LatestRevisionDate: 17-Jul-2002; LatestRevisionNote: Re-released for DXP Platform.; PackageReference: SMD; Publisher: Altium Limited
R25-R27 R35-R37 = Resistor: Generic Resistor; Manufacturer: Yageo; Manufacturer Part Number: AC0805FR-0710KL; Tolerance: 1%; Temperature Coefficient: 100ppm/°C; Power Rating: 125mW; Voltage Rating: 150V; Supplier 1: Digi-Key; Supplier Part Number 1: 311-10KLGCT-ND; RoHS: Yes; Stock 1: 812288; Pricing 1: 1 = 0.10000, 10 = 0.05000, 100 = 0.02050, 1000 = 0.00921, 2500 = 0.00799 (USD); Case/Package: 0805; Case Code (Metric): 2012; Case Code (Imperial): 0805; Min Operating Temperature: -55°C; Max Operating Temperature: 155°C; Packaging: Tape and Reel; Resistance: 10kR; Composition: Thick Film; Number of Terminations: 2; Termination: SMD/SMT; Max Power Dissipation: 125mW; Features: Anti-Sulfur,Automotive AEC-Q200,Moisture Resistant; Package Quantity: 1; Military Standard: Not; Length: 0.079inch; Height: 0.024inch; Width: 0.049inch; Depth: 1.25mm; Lead Free: Lead Free; ComponentLink1URL: http://www.yageo.com/NewPortal/yageodocoutput?fileName=/pdf/R-Chip/PYu-AC_51_RoHS_L_6.pdf; ComponentLink1Description: http://www.yageo.com/NewPortal/yageodocoutput?fileName=/pdf/R-Chip/PYu-AC_51_RoHS_L_6.pdf
R30 = Resistor: Generic Resistor; Manufacturer: Bourns; Manufacturer Part Number: CRA2512-FZ-R080ELF; Power Rating: 3W; Tolerance: 1%; Temperature Coefficient: 75ppm/°C; Supplier 1: Digi-Key; Supplier Part Number 1: CRA2512-FZ-R080ELFCT-ND; RoHS: Yes; Stock 1: 115511; Pricing 1: 1 = 0.69000, 10 = 0.57800, 25 = 0.49560, 50 = 0.44600, 100 = 0.38810, 250 = 0.34684, 500 = 0.28078, 1000 = 0.22710 (USD); Mount: Surface Mount; Case/Package: 2512; Number of Pins: 2; Weight: 0.001429oz; Case Code (Imperial): 2512; Case Code (Metric): 6432; Contact Plating: Tin; Min Operating Temperature: -55°C; Max Operating Temperature: 170°C; Resistance: 80mR; Packaging: Tape and Reel; Package Quantity: 1; Termination: SMD/SMT; Composition: Metal Film,Thick Film; Number of Terminations: 2; Military Standard: Not; Max Power Dissipation: 3W; Features: Moisture Resistant; Length: 6.4mm; Height: 0.6mm; Width: 3.2mm; Depth: 3.2mm; Radiation Hardening: No; REACH SVHC: No SVHC; ComponentLink1URL: http://www.bourns.com/data/global/pdfs/CRA.pdf; ComponentLink1Description: http://www.bourns.com/data/global/pdfs/CRA.pdf; ComponentLink2URL: http://www.bourns.com/docs/Product-Datasheets/CRA.pdf; ComponentLink2Description: http://www.bourns.com/docs/Product-Datasheets/CRA.pdf; ComponentLink3URL: https://www.bourns.com/docs/Product-Datasheets/CRA.pdf; ComponentLink3Description: https://www.bourns.com/docs/Product-Datasheets/CRA.pdf; ComponentLink4URL: http://www.farnell.com/datasheets/2253366.pdf; ComponentLink4Description: http://www.farnell.com/datasheets/2253366.pdf; ComponentLink5URL: http://uk.rs-online.com/webdocs/0ddc/0900766b80ddce06.pdf; ComponentLink5Description: http://uk.rs-online.com/webdocs/0ddc/0900766b80ddce06.pdf
R32 R33 = Resistor: Generic Resistor; Manufacturer: Yageo; Manufacturer Part Number: AC0805FR-0710RL; Tolerance: 1%; Temperature Coefficient: 200ppm/°C; Power Rating: 125mW; Voltage Rating: 150V; Supplier 1: Digi-Key; Supplier Part Number 1: YAG3690CT-ND; RoHS: Yes; Stock 1: 569278; Pricing 1: 1 = 0.10000, 10 = 0.09000, 100 = 0.03460, 1000 = 0.01522, 2500 = 0.01315 (USD); Case/Package: 0805; Case Code (Imperial): 0805; Case Code (Metric): 2012; Min Operating Temperature: -55°C; Max Operating Temperature: 155°C; Resistance: 10R; Composition: Thick Film; Packaging: Tape and Reel; Number of Terminations: 2; Max Power Dissipation: 125mW; Termination: SMD/SMT; Features: Automotive AEC-Q200,Moisture Resistant; Military Standard: Not; Length: 2mm; Height: 0.024inch; Width: 1.25mm; Depth: 1.25mm; Lead Free: Lead Free
S1 = Slide_DPDT: Slide Switch DPDT; Manufacturer: ITT C&K; Manufacturer Part Number: JS202011CQN; Actuator Material: Nylon,Polyamide; Max Voltage Rating (DC): 6V; Contact Resistance: 70mR; Max Current Rating: 300mA; Contact Current Rating: 100mA; Illumination Type: Non-Illuminated; Electrical Life: 5000Cycles; Switch Travel: 2mm; Switch Function: On-On; Actuator Type: Standard; Supplier 1: Digi-Key; Supplier Part Number 1: 401-2001-ND; Stock 1: 46355; Pricing 1: 1 = 0.43000, 10 = 0.41600, 25 = 0.40720, 50 = 0.36380, 100 = 0.34650, 250 = 0.33784, 500 = 0.28586, 1000 = 0.27720, 5000 = 0.24255 (USD); RoHS: Yes; Mount: Through Hole; Contact Material: Copper Alloy; Contact Plating: Silver; Housing Material: Nylon; Min Operating Temperature: -40°C; Max Operating Temperature: 85°C; Throw Configuration: DPDT; Termination: PC Pins; Voltage Rating (DC): 6V; Current Rating: 300mA; Package Quantity: 1; Packaging: Bulk; Orientation: Vertical; Length: 9mm; Depth: 3.6mm; Actuator Length: 2mm; Radiation Hardening: No; REACH SVHC: No SVHC; Lead Free: Lead Free; Flammability Rating: UL94 V-0; ComponentLink1URL: http://www.farnell.com/datasheets/1707718.pdf?src-supplier=Element14; ComponentLink1Description: http://www.farnell.com/datasheets/1707718.pdf?src-supplier=Element14; ComponentLink2URL: http://www.ck-components.com/14398/js_1nov12.pdf/?src-supplier=Avnet; ComponentLink2Description: http://www.ck-components.com/14398/js_1nov12.pdf/?src-supplier=Avnet; ComponentLink3URL: https://www.ckswitches.com/media/1422/js.pdf?src-supplier=Digi-Key; ComponentLink3Description: https://www.ckswitches.com/media/1422/js.pdf?src-supplier=Digi-Key
U1 U2 = ADM3260ARSZ: ANALOG DEVICES         ADM3260ARSZ            Digital Isolator, 2 Channel, 3 V, 5.5 V, SSOP, 20 Pins; Number of Channels: 2; Min Supply Voltage: 3V; Max Supply Voltage: 5.5V; Channel Type: Bidirectional; Data Rate: 1Mbps; Operating Supply Current: 9.5mA; Isolated Power: Yes; Pulse Width Distortion (PWD): 85ns; Max Output Current: 30mA; Rise Time: 1.2us; Propagation Delay: 95ns; Max Power Dissipation: 2.5W; Supplier 1: Digi-Key; Manufacturer: Analog Devices; RoHS: Yes; Stock 1: 7547; Pricing 1: 1 = 8.26000, 66 = 7.11348, 132 = 6.17659, 528 = 5.37850, 1056 = 4.68450 (USD); Mount: Surface Mount; Case/Package: SSOP; Number of Pins: 20; Weight: 0.016oz; Contact Plating: Matte,Tin; Min Operating Temperature: -40°C; Max Operating Temperature: 105°C; Packaging: Rail/Tube; Max Input Current: 30mA; Polarity: Bidirectional; Package Quantity: 66; Length: 7.5mm; Depth: 1.95mm; Width: 5.6mm; Lead Free: Contains Lead; REACH SVHC: No SVHC; Supplier Part Number 1: ADM3260ARSZ-ND; Manufacturer Part Number: ADM3260ARSZ
U3 U4 = INA196AIDBVR: IC CURRENT MONITOR 3% SOT23-5; Manufacturer: Texas Instruments; Max Input Voltage: 80V; Min Input Voltage: -16V; Number of Channels: 1; Common Mode Rejection Ratio: 80dB; Max Supply Voltage: 18V; Min Supply Voltage: 2.7V; Operating Supply Current: 900uA; Number of Amplifiers: 2; Input Bias Current: 16uA; Bandwidth: 500kHz; Input Offset Voltage (Vos): 2mV; Voltage Gain: 26.02dB; Power Supply Rejection Ratio (PSRR): 106dB; Quiescent Current: 700uA; Output Type: Voltage; Supplier 1: Digi-Key; RoHS: Yes; Stock 1: 52256; Pricing 1: 1 = 2.27000, 10 = 2.04200, 100 = 1.64100, 500 = 1.34828, 1000 = 1.11714 (USD); Case/Package: SOT-23; Number of Pins: 5; Weight: 0.000617oz; Contact Plating: Matte,Tin; Min Operating Temperature: -40°C; Max Operating Temperature: 125°C; Packaging: Tape and Reel; Package Quantity: 1; Number of Elements: 2; Accuracy: 3%; Radiation Hardening: No; REACH SVHC: No SVHC; Lead Free: Lead Free; ComponentLink1URL: http://www.ti.com/general/docs/lit/getliterature.tsp?genericPartNumber=INA193&&fileType=pdf; ComponentLink1Description: http://www.ti.com/general/docs/lit/getliterature.tsp?genericPartNumber=INA193&&fileType=pdf; ComponentLink2URL: http://www.ti.com/lit/ds/symlink/ina193.pdf; ComponentLink2Description: http://www.ti.com/lit/ds/symlink/ina193.pdf; ComponentLink3URL: https://www.verical.com/server-webapp/html/getDatasheet?partID=241489; ComponentLink3Description: https://www.verical.com/server-webapp/html/getDatasheet?partID=241489; ComponentLink4URL: http://www.produktinfo.conrad.com/datenblaetter/1000000-1099999/001013575-da-01-en-IC_CURRENT_MONITO_INA196AIDBVR_SOT_5_TID.pdf; ComponentLink4Description: http://www.produktinfo.conrad.com/datenblaetter/1000000-1099999/001013575-da-01-en-IC_CURRENT_MONITO_INA196AIDBVR_SOT_5_TID.pdf; Supplier Part Number 1: 296-26068-1-ND; Manufacturer Part Number: INA196AIDBVR
U5 = MIC2250-2YD5TR: Conv DC-DC Single Step Up 2.5V to 5.5V 5-Pin TSOT-23 T/R; Manufacturer: Microchip Micrel; Number of Outputs: 1; Min Output Voltage: 1.24V; Max Output Voltage: 32V; Output Current: 900mA; Switching Frequency: 2.5MHz; Synchronous Rectifier: No; Topology: Boost; Output Type: Adjustable; Output Configuration: Positive; Efficiency: 90%; Max Output Current: 2A; Supplier 1: Digikey; RoHS: Yes; Stock 1: 5054; Pricing 1: 1 = 0.73000, 25 = 0.61800, 100 = 0.55620 (USD); Mount: Surface Mount; Case/Package: SOT-23-5; Number of Pins: 5; Min Operating Temperature: -40°C; Max Operating Temperature: 125°C; Min Input Voltage: 2.5V; Max Input Voltage: 5.5V; Packaging: Tape and Reel; Package Quantity: 1; Output Voltage: 32V; Length: 2.9mm; Height: 0.87mm; Width: 1.6mm; ComponentLink1URL: http://www.micrel.com/_PDF/mic2250.pdf; ComponentLink1Description: http://www.micrel.com/_PDF/mic2250.pdf; Supplier Part Number 1: 576-3968-1-ND; Manufacturer Part Number: MIC2250-2YD5TR
U6 = ADS1115IDGSR: IC ADC 16BIT 860SPS LP 10MSOP; Manufacturer: Texas Instruments; Interface: I2C; Number of Bits: 16; Sampling Rate: 860S/s; Number of A/D Converters: 1; Resolution: 16b; Polarity: Bipolar; Min Supply Voltage: 2V; Max Supply Voltage: 5.5V; Supply Type: Single; Conversion Rate: 0.86KS/s; Number of Inputs: 4; Integral Nonlinearity (INL): 1LSB; Power Dissipation: 900uW; Supplier 1: Digi-Key; RoHS: Yes; Stock 1: 20056; Pricing 1: 1 = 5.52000, 10 = 4.96200, 100 = 4.06520, 500 = 3.46064, 1000 = 2.91861 (USD); Case/Package: VSSOP; Number of Pins: 10; Contact Plating: Gold; Min Operating Temperature: -40°C; Max Operating Temperature: 125°C; Package Quantity: 2500; Packaging: Tape and Reel; Number of Converters: 1; Max Supply Voltage (DC): 5.5V; Min Supply Voltage (DC): 2V; Radiation Hardening: No; REACH SVHC: No SVHC; Lead Free: Lead Free; ComponentLink1URL: http://components.arrow.com/part/dataview/47725463S8438921N7713; ComponentLink1Description: http://components.arrow.com/part/dataview/47725463S8438921N7713; ComponentLink2URL: http://www.ti.com/lit/ds/sbas444b/sbas444b.pdf; ComponentLink2Description: http://www.ti.com/lit/ds/sbas444b/sbas444b.pdf; ComponentLink3URL: http://www.ti.com/lit/ds/symlink/ads1113.pdf; ComponentLink3Description: http://www.ti.com/lit/ds/symlink/ads1113.pdf; Supplier Part Number 1: 296-38849-1-ND; Manufacturer Part Number: ADS1115IDGSR
U7 = SN74AHC126D: IC BUS BUFFER TRI-ST QD 14SOIC; Manufacturer: Texas Instruments; Propagation Delay: 7.5ns; Number of Outputs: 4; Logic Function: Buffer,Inverting; Min Supply Voltage: 2V; Max Supply Voltage: 5.5V; Low Level Output Current: 8mA; Polarity: Non-Inverting; Number of Bits per Element: 1; High Level Output Current: -8mA; Turn-On Delay Time: 15ns; Quiescent Current: 4uA; Supplier 1: Digi-Key; RoHS: Yes; Stock 1: 2707; Pricing 1: 1 = 0.40000, 10 = 0.34100, 50 = 0.31860, 100 = 0.25480, 500 = 0.20020, 1000 = 0.15470, 2500 = 0.14105, 5000 = 0.13195 (USD); Mount: Surface Mount; Case/Package: SOIC; Number of Pins: 14; Min Operating Temperature: -40°C; Max Operating Temperature: 85°C; Package Quantity: 50; Packaging: Rail/Tube; Number of Elements: 4; Number of Input Lines: 4; Number of Output Lines: 4; Number of Channels: 4; Number of Inputs: 4; Number of Bits: 4; Termination: SMD/SMT; Length: 8.65mm; Height: 1.58mm; Width: 3.91mm; Radiation Hardening: No; Lead Free: Lead Free; REACH SVHC: No SVHC; ComponentLink1URL: http://www.ti.com/general/docs/lit/getliterature.tsp?genericPartNumber=SN54AHC126&&fileType=pdf; ComponentLink1Description: http://www.ti.com/general/docs/lit/getliterature.tsp?genericPartNumber=SN54AHC126&&fileType=pdf; ComponentLink2URL: http://www.ti.com/lit/ds/symlink/sn54ahc126.pdf; ComponentLink2Description: http://www.ti.com/lit/ds/symlink/sn54ahc126.pdf; ComponentLink3URL: http://www.ti.com/lit/ds/symlink/sn74ahc126.pdf; ComponentLink3Description: http://www.ti.com/lit/ds/symlink/sn74ahc126.pdf; ComponentLink4URL: http://www.produktinfo.conrad.com/datenblaetter/1000000-1099999/001016179-da-01-en-IC_BUS_BUFER_QD_SN74AHC126D_SOIC_14_TID.pdf; ComponentLink4Description: http://www.produktinfo.conrad.com/datenblaetter/1000000-1099999/001016179-da-01-en-IC_BUS_BUFER_QD_SN74AHC126D_SOIC_14_TID.pdf; Supplier Part Number 1: 296-26392-5-ND; Manufacturer Part Number: SN74AHC126D
U8 = INA226AQDGSRQ1: IC MONITOR PWR/CURR BIDIR 10MSOP; Manufacturer: Texas Instruments; Function: Current Monitor; Sensing Method: High/Low-Side; Accuracy: ±0.02%; Voltage - Input: 0 V ~ 36 V; Current - Output: 10mA; Supplier 1: Digi-Key; RoHS: RoHS Compliant; Category: Integrated Circuits (ICs); Stock 1: 1929; Pricing 1: 1=4.06, 10=3.645, 100=2.9866, 500=2.54248, 1000=2.14425 (USD); Packaging: Cut Tape (CT); Part Status: Active; Operating Temperature: -40°C ~ 125°C; Mounting Type: Surface Mount; Package / Case: 10-TFSOP, 10-MSOP (0.118", 3.00mm Width); Supplier Device Package: 10-VSSOP; ComponentLink1URL: http://www.ti.com/lit/ds/symlink/ina226-q1.pdf; ComponentLink1Description: http://www.ti.com/lit/ds/symlink/ina226-q1.pdf; Supplier Part Number 1: 296-42503-1-ND; Manufacturer Part Number: INA226AQDGSRQ1
U9 = BME280: PRESSURE HUMIDITY TEMP GAS SENS; Manufacturer: Bosch Sensortec; Accuracy: ±0.145 PSI (±1 kPa); Operating Pressure: 4.35 PSI ~ 15.95 PSI (30 kPa ~ 110 kPa); Output Type: I²C, SPI; Pressure Type: Vented Gauge; Output: 16b; Voltage - Supply: 1.71 V ~ 3.6 V; Maximum Pressure: ±290.08 PSI (±2000 kPa); Supplier 1: Digi-Key; Supplier Part Number 1: 828-1063-1-ND; RoHS: RoHS Compliant; Category: Sensors, Transducers; Stock 1: 0; Pricing 1: 1=11, 5=9.652, 10=8.687, 25=7.722, 50=7.1428, 100=6.1776, 500=5.7915, 1000=5.4054, 5000=5.13513 (USD); Package / Case: 8-SMD; ComponentLink1URL: https://ae-bst.resource.bosch.com/media/_tech/media/datasheets/BST-BME280_DS001-11.pdf; ComponentLink1Description: https://ae-bst.resource.bosch.com/media/_tech/media/datasheets/BST-BME280_DS001-11.pdf; Manufacturer Part Number: BME280; Port Size: -; Port Style: -; Features: Standby Mode; Termination Style: SMD (SMT) Tab; Operating Temperature: -40°C ~ 85°C; Supplier Device Package: 8-SMD